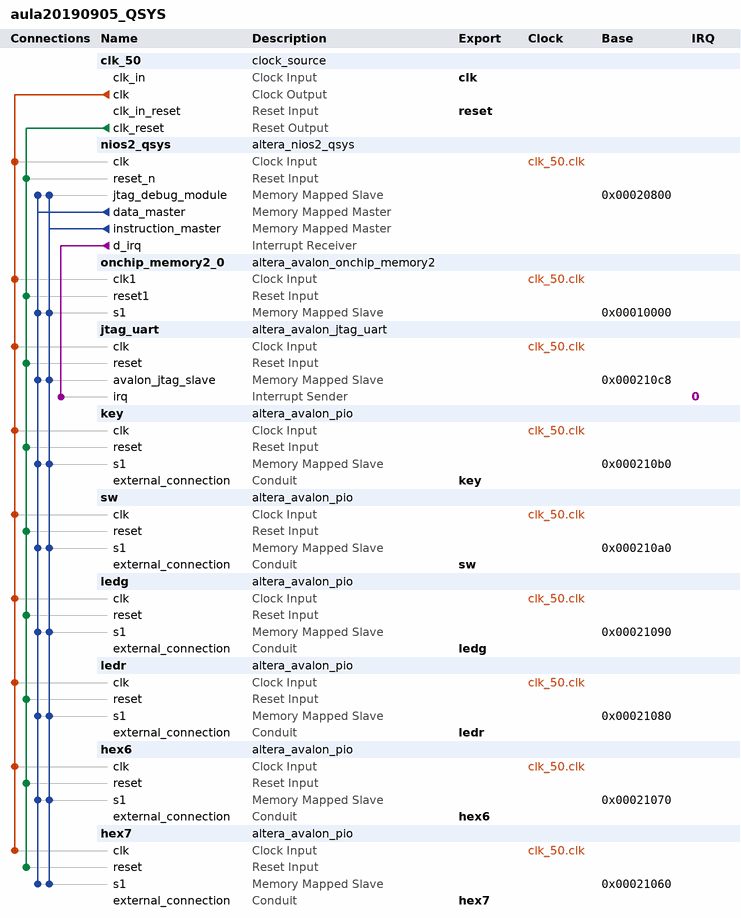
[diagram p0: system contents]
# Platform Designer (Qsys) system aula20190905_QSYS, Cyclone II EP2C35F672C6
# Parameters at their usual value, and those the tool derives, are not listed.
package require -exact qsys 13.0.1.99.2
create_system aula20190905_QSYS
set_project_property DEVICE_FAMILY {Cyclone II}
set_project_property DEVICE EP2C35F672C6

add_instance clk_50 clock_source 13.0
set_instance_parameter_value clk_50 clockFrequency 50000000

add_instance nios2_qsys altera_nios2_qsys 13.0
set_instance_parameter_value nios2_qsys resetSlave onchip_memory2_0.s1
set_instance_parameter_value nios2_qsys mmu_TLBMissExcSlave None
set_instance_parameter_value nios2_qsys exceptionSlave onchip_memory2_0.s1
set_instance_parameter_value nios2_qsys breakSlave nios2_qsys.jtag_debug_module
set_instance_parameter_value nios2_qsys impl Tiny
set_instance_parameter_value nios2_qsys icache_size 4096

add_instance onchip_memory2_0 altera_avalon_onchip_memory2 13.0.1.99.2
set_instance_parameter_value onchip_memory2_0 dataWidth 32
set_instance_parameter_value onchip_memory2_0 dualPort false
set_instance_parameter_value onchip_memory2_0 initMemContent true
set_instance_parameter_value onchip_memory2_0 initializationFileName onchip_mem.hex
set_instance_parameter_value onchip_memory2_0 memorySize 40960

add_instance jtag_uart altera_avalon_jtag_uart 13.0.1.99.2
set_instance_parameter_value jtag_uart simInteractiveOptions NO_INTERACTIVE_WINDOWS

add_instance key altera_avalon_pio 13.0.1.99.2
set_instance_parameter_value key direction Input
set_instance_parameter_value key width 4

add_instance sw altera_avalon_pio 13.0.1.99.2
set_instance_parameter_value sw direction Input
set_instance_parameter_value sw width 8

add_instance ledg altera_avalon_pio 13.0.1.99.2
set_instance_parameter_value ledg direction Output
set_instance_parameter_value ledg width 8

add_instance ledr altera_avalon_pio 13.0.1.99.2
set_instance_parameter_value ledr direction Output
set_instance_parameter_value ledr width 8

add_instance hex6 altera_avalon_pio 13.0.1.99.2
set_instance_parameter_value hex6 direction Output
set_instance_parameter_value hex6 width 7

add_instance hex7 altera_avalon_pio 13.0.1.99.2
set_instance_parameter_value hex7 direction Output
set_instance_parameter_value hex7 width 7

# connections
add_connection clk_50.clk hex6.clk clock
add_connection clk_50.clk hex7.clk clock
add_connection clk_50.clk jtag_uart.clk clock
add_connection clk_50.clk key.clk clock
add_connection clk_50.clk ledg.clk clock
add_connection clk_50.clk ledr.clk clock
add_connection clk_50.clk nios2_qsys.clk clock
add_connection clk_50.clk onchip_memory2_0.clk1 clock
add_connection clk_50.clk sw.clk clock
add_connection clk_50.clk_reset hex6.reset reset
add_connection clk_50.clk_reset hex7.reset reset
add_connection clk_50.clk_reset jtag_uart.reset reset
add_connection clk_50.clk_reset key.reset reset
add_connection clk_50.clk_reset ledg.reset reset
add_connection clk_50.clk_reset ledr.reset reset
add_connection clk_50.clk_reset nios2_qsys.reset_n reset
add_connection clk_50.clk_reset onchip_memory2_0.reset1 reset
add_connection clk_50.clk_reset sw.reset reset
add_connection nios2_qsys.data_master hex6.s1 avalon
set_connection_parameter_value nios2_qsys.data_master/hex6.s1 baseAddress 0x00021070
add_connection nios2_qsys.data_master hex7.s1 avalon
set_connection_parameter_value nios2_qsys.data_master/hex7.s1 baseAddress 0x00021060
add_connection nios2_qsys.data_master jtag_uart.avalon_jtag_slave avalon
set_connection_parameter_value nios2_qsys.data_master/jtag_uart.avalon_jtag_slave baseAddress 0x000210c8
add_connection nios2_qsys.data_master key.s1 avalon
set_connection_parameter_value nios2_qsys.data_master/key.s1 baseAddress 0x000210b0
add_connection nios2_qsys.data_master ledg.s1 avalon
set_connection_parameter_value nios2_qsys.data_master/ledg.s1 baseAddress 0x00021090
add_connection nios2_qsys.data_master ledr.s1 avalon
set_connection_parameter_value nios2_qsys.data_master/ledr.s1 baseAddress 0x00021080
add_connection nios2_qsys.data_master nios2_qsys.jtag_debug_module avalon
set_connection_parameter_value nios2_qsys.data_master/nios2_qsys.jtag_debug_module baseAddress 0x00020800
add_connection nios2_qsys.data_master onchip_memory2_0.s1 avalon
set_connection_parameter_value nios2_qsys.data_master/onchip_memory2_0.s1 baseAddress 0x00010000
add_connection nios2_qsys.data_master sw.s1 avalon
set_connection_parameter_value nios2_qsys.data_master/sw.s1 baseAddress 0x000210a0
add_connection nios2_qsys.instruction_master hex6.s1 avalon
set_connection_parameter_value nios2_qsys.instruction_master/hex6.s1 baseAddress 0x00021070
add_connection nios2_qsys.instruction_master hex7.s1 avalon
set_connection_parameter_value nios2_qsys.instruction_master/hex7.s1 baseAddress 0x00021060
add_connection nios2_qsys.instruction_master jtag_uart.avalon_jtag_slave avalon
set_connection_parameter_value nios2_qsys.instruction_master/jtag_uart.avalon_jtag_slave baseAddress 0x000210c8
add_connection nios2_qsys.instruction_master key.s1 avalon
set_connection_parameter_value nios2_qsys.instruction_master/key.s1 baseAddress 0x000210b0
add_connection nios2_qsys.instruction_master ledg.s1 avalon
set_connection_parameter_value nios2_qsys.instruction_master/ledg.s1 baseAddress 0x00021090
add_connection nios2_qsys.instruction_master ledr.s1 avalon
set_connection_parameter_value nios2_qsys.instruction_master/ledr.s1 baseAddress 0x00021080
add_connection nios2_qsys.instruction_master nios2_qsys.jtag_debug_module avalon
set_connection_parameter_value nios2_qsys.instruction_master/nios2_qsys.jtag_debug_module baseAddress 0x00020800
add_connection nios2_qsys.instruction_master onchip_memory2_0.s1 avalon
set_connection_parameter_value nios2_qsys.instruction_master/onchip_memory2_0.s1 baseAddress 0x00010000
add_connection nios2_qsys.instruction_master sw.s1 avalon
set_connection_parameter_value nios2_qsys.instruction_master/sw.s1 baseAddress 0x000210a0
add_connection nios2_qsys.d_irq jtag_uart.irq interrupt
set_connection_parameter_value nios2_qsys.d_irq/jtag_uart.irq irqNumber 0

# exported interfaces
add_interface clk clock sink
set_interface_property clk EXPORT_OF clk_50.clk_in
add_interface reset reset sink
set_interface_property reset EXPORT_OF clk_50.clk_in_reset
add_interface key conduit end
set_interface_property key EXPORT_OF key.external_connection
add_interface sw conduit end
set_interface_property sw EXPORT_OF sw.external_connection
add_interface ledg conduit end
set_interface_property ledg EXPORT_OF ledg.external_connection
add_interface ledr conduit end
set_interface_property ledr EXPORT_OF ledr.external_connection
add_interface hex6 conduit end
set_interface_property hex6 EXPORT_OF hex6.external_connection
add_interface hex7 conduit end
set_interface_property hex7 EXPORT_OF hex7.external_connection

set_interconnect_requirement {$system} qsys_mm.clockCrossingAdapter HANDSHAKE
set_interconnect_requirement {$system} qsys_mm.maxAdditionalLatency 1

save_system aula20190905_QSYS.qsys
